# EAGLE design v0.1 (EAGLE 5.11)
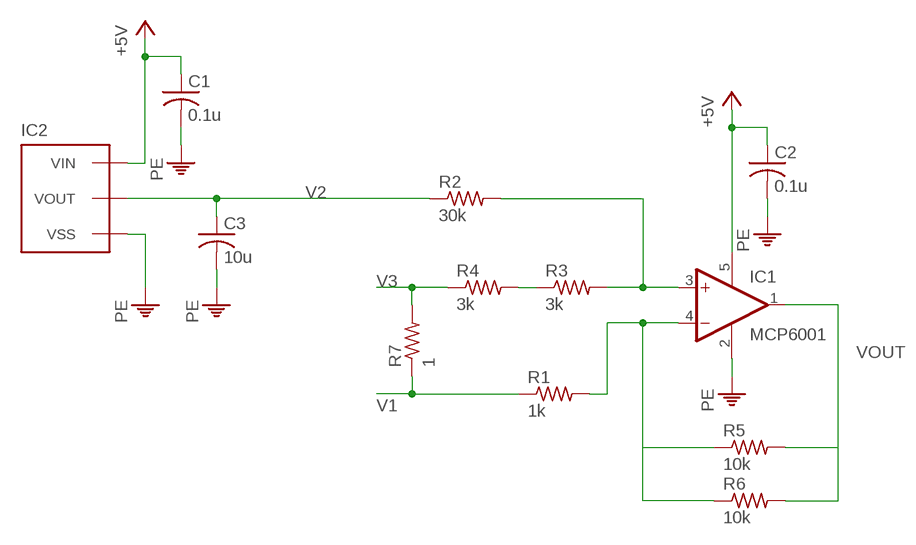
[diagram p0: schematic, sheet 1]

## Parts
C1  0.1u  C-USC0805  [C0805]
C2  0.1u  C-USC0805  [C0805]
C3  10u  C-USC0805  [C0805]
IC1  MCP6001  [SOT-23-5L]
IC2  MCP1525  [SOT23]
R1  1k  R-US_R0805  [R0805]
R2  30k  R-US_R0805  [R0805]
R3  3k  R-US_R0805  [R0805]
R4  3k  R-US_R0805  [R0805]
R5  10k  R-US_R0805  [R0805]
R6  10k  R-US_R0805  [R0805]
R7  1  R-US_R2512  [R2512]

## Nets
+5V: C1.1 C2.1 IC1.5(V+) IC2.1(VIN)
N$1: IC1.3(+IN) R2.2 R3.2
N$6: R3.1 R4.2
N$9: IC1.4(-IN) R1.2 R5.1 R6.1
PE: C1.2 C2.2 C3.2 IC1.2(V-) IC2.3(VSS)
V1: R1.1 R7.1
V2: C3.1 IC2.2(VOUT) R2.1
V3: R4.1 R7.2
VOUT: IC1.1(OUT) R5.2 R6.2

## Library data of the parts
C1-C3 = rcl:C-US: CAPACITOR, American symbol
IC1 = Alan Rosenthal:MCP6001
IC2 = Alan Rosenthal:MCP1525
R1-R7 = rcl:R-US_: RESISTOR, American symbol

## Board
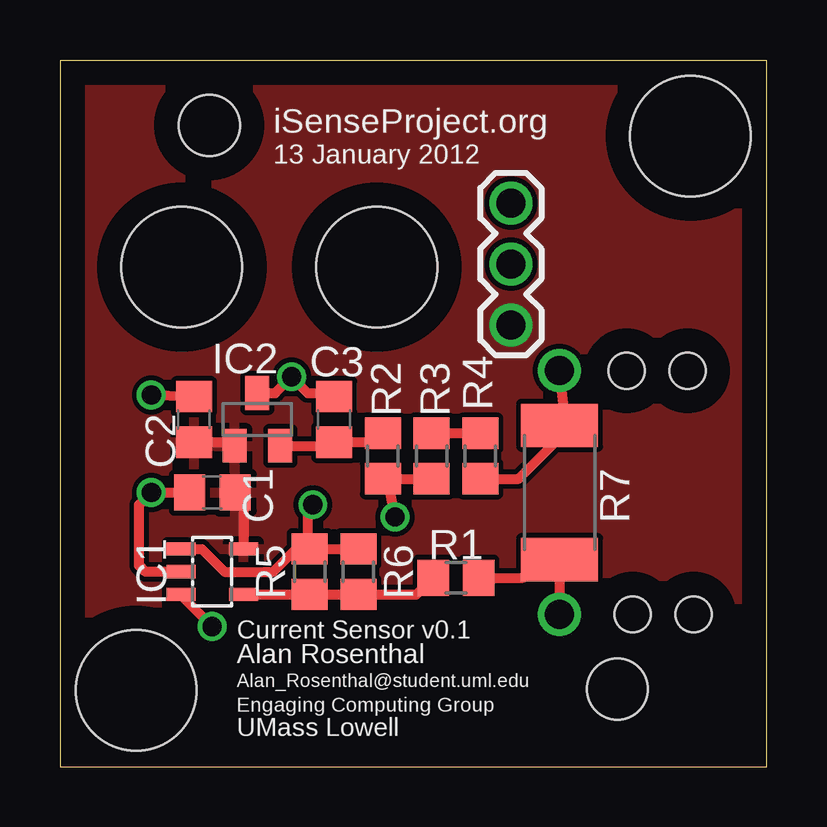
[diagram p1: board, top side]
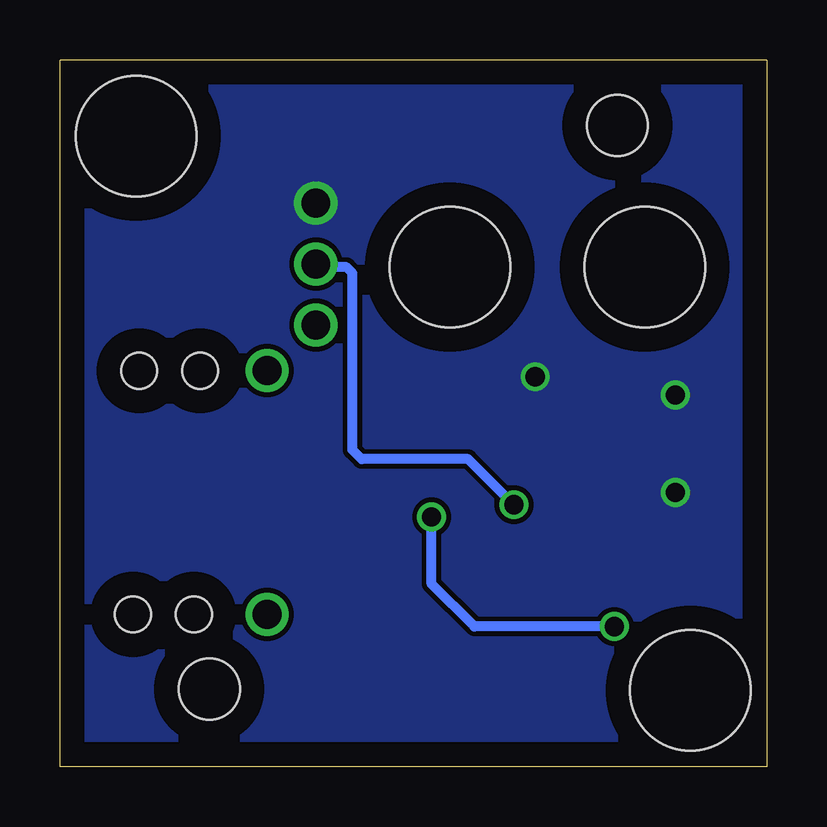
[diagram p2: board, bottom side, seen from below]

Size 29.46 x 29.46 mm. Coordinates in mm from the lower left corner, seen from the top.
Outline: 0,29.46 0,0 29.46,0 29.46,29.46 0,29.46
Copper layers (1*16): Top 0.035mm / dielectric 1.5mm / Bottom 0.035mm
Design rules "default": minimum track width 10mil, minimum drill 24mil, track to track 8mil, track to pad 8mil, pad to pad 8mil, via to via 8mil, smd to smd 8mil, copper to edge 40mil, drill to drill 8mil, minimum pad ring 10mil, minimum via ring 8mil, stop-mask expansion 4mil, vias tented up to drill 0mil, thermal gap 10mil
Holes 5.03 mm at 5.08,20.83 13.21,20.83 3.17,3.17 26.29,26.29
Holes 2.54 mm at 6.22,26.73 23.24,3.24
Holes 1.5 mm at 23.62,16.51 26.16,16.51 26.42,6.35 23.88,6.35

### Footprints (pad centres in the part's own frame; a part is rotated, then mirrored left to right if it is on the bottom)
C0805 = smd 1.3 x 1.5: 1 -0.95,0; 2 0.95,0
SOT-23-5L = smd 0.55 x 1.2: 1 -2.22,-1.3; 2 -1.27,-1.3; 3 -0.32,-1.3; 4 -0.32,1.3; 5 -2.22,1.3
SOT23 = smd 1 x 1.4: 1 -0.85,-1.1; 2 1.05,-1.1; 3 0.1,1.1
R0805 = smd 1.3 x 1.5: 1 -0.95,0; 2 0.95,0
R2512 = smd 1.8 x 3.2: 1 -2.8,0; 2 2.8,0

### Placement (x,y rotation side)
C1  6.35,11.43 180 top
C2  5.59,14.48 90 top
C3  11.43,14.48 90 top
IC1  6.35,6.86 270 top
IC2  8.13,14.48 0 top
R1  16.51,7.87 180 top
R2  13.46,12.95 270 top
R3  15.49,12.95 270 top
R4  17.53,12.95 90 top
R5  10.41,8.13 90 top
R6  12.45,8.13 90 top
R7  20.83,11.43 90 top

### Tracks (layer width: path | path; a pad name or v marks a point on that pad's centre or on a via)
+5V  (via drill 1.2)
  Top 0.406: C2.1 7.13,13.53 | IC1.5 7.65,11.08 C1.1
  other vias: 18.8,18.41
  pour Top: -0.38,29.84 29.84,29.84 30.1,0 0,0 -0.64,10.79
N$1  (via drill 0.8)
  Top 0.406: R3.2 R2.2 13.72,11.75 v13.97,10.41 | IC1.3 5.05,7.14 v6.35,5.84
  Bottom 0.406: v13.97,10.41 13.97,7.62 12.19,5.84 v6.35,5.84
N$6
  Top 0.406: R3.1 R4.2
N$9
  Top 0.406: R1.2 14.86,7.18 R6.1 R5.1 IC1.4
PE  (via drill 0.8, 1.2)
  Top 0.406: 8.08,15.43 IC2.3 8.97,15.58 v9.65,16.26 10.33,15.58 10.77,15.58 C3.2 | IC1.2 3.56,8.13 3.3,8.38 3.3,10.92 v3.81,11.43 C1.2 | C2.2 6.03,15.43 v3.81,15.49
  other vias: 18.8,23.5
  pour Bottom: 0,29.72 29.46,29.46 29.46,0 0,0
V1  (via drill 1.2)
  Top 0.406: R1.1 19.3,7.87 20.06,8.63 R7.1 v20.83,6.35
V2
  Top 0.406: IC2.2 10.77,13.38 C3.1 13.09,13.53 R2.1 13.4,13.97
V3  (via drill 1.2)
  Top 0.406: R4.1 19.12,12 20.57,13.46 20.57,13.98 R7.2 21.08,14.48 v20.83,16.51
VOUT  (via drill 0.8, 1.2)
  Top 0.406: R6.2 R5.2 10.35,9.14 | IC1.1 5.91,9.08 6.86,8.13 8.89,8.13 9.91,9.14 10.35,9.14 | 10.35,9.14 10.35,10.73 v10.54,10.92
  Bottom 0.406: v10.54,10.92 12.45,12.83 16.89,12.83 17.27,13.21 17.27,20.57 17.53,20.83 18.67,20.83 v18.8,20.95

### Text on the board
tNames: iSenseProject.org | 13 January 2012 | Current Sensor v0.1 | Alan Rosenthal | Alan_Rosenthal@student.uml.edu | Engaging Computing Group | UMass Lowell
tDocu: GND | SIG | +5V